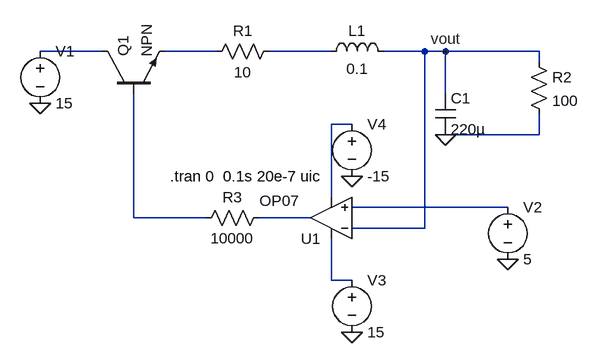
[diagram p0: schematic on_off_simple.asc]
on_off_simple.asc, the LTspice schematic file:
Version 4
SHEET 1 880 680
WIRE -256 32 -352 32
WIRE -80 32 -160 32
WIRE 96 32 0 32
WIRE 240 32 176 32
WIRE 272 32 240 32
WIRE 416 32 272 32
WIRE 416 48 416 32
WIRE 272 96 272 32
WIRE 128 144 96 144
WIRE 416 160 416 128
WIRE 416 160 272 160
WIRE 96 256 96 144
WIRE 368 272 128 272
WIRE -208 288 -208 96
WIRE -96 288 -208 288
WIRE 64 288 -16 288
WIRE 240 304 240 32
WIRE 240 304 128 304
WIRE 96 384 96 320
WIRE 128 384 96 384
FLAG 272 160 0
FLAG 272 32 vout
FLAG -352 112 0
FLAG 128 224 0
FLAG 128 464 0
FLAG 368 352 0
SYMBOL cap 256 96 R0
SYMATTR InstName C1
SYMATTR Value 220µ
SYMBOL res 16 16 R90
WINDOW 0 0 56 VBottom 2
WINDOW 3 32 56 VTop 2
SYMATTR InstName R1
SYMATTR Value 10
SYMBOL ind 80 48 R270
WINDOW 0 32 56 VTop 2
WINDOW 3 5 56 VBottom 2
SYMATTR InstName L1
SYMATTR Value 0.1
SYMBOL voltage -352 16 R0
WINDOW 123 0 0 Left 0
WINDOW 39 0 0 Left 0
SYMATTR InstName V1
SYMATTR Value 15
SYMBOL res 400 32 R0
SYMATTR InstName R2
SYMATTR Value 100
SYMBOL npn -256 96 R270
SYMATTR InstName Q1
SYMBOL res 0 272 R90
WINDOW 0 0 56 VBottom 2
WINDOW 3 32 56 VTop 2
SYMATTR InstName R3
SYMATTR Value 10000
SYMBOL OpAmps\\OP07 96 352 R180
WINDOW 3 49 90 Left 2
SYMATTR InstName U1
SYMBOL voltage 368 256 R0
WINDOW 123 0 0 Left 0
WINDOW 39 0 0 Left 0
SYMATTR InstName V2
SYMATTR Value 5
SYMBOL voltage 128 368 R0
WINDOW 123 0 0 Left 0
WINDOW 39 0 0 Left 0
SYMATTR InstName V3
SYMATTR Value 15
SYMBOL voltage 128 128 R0
WINDOW 123 0 0 Left 0
WINDOW 39 0 0 Left 0
SYMATTR InstName V4
SYMATTR Value -15
TEXT -152 224 Left 2 !.tran 0  0.1s 20e-7 uic

The netlist it stands for:
* on_off_simple.asc
C1 vout 0 220µ
R1 N003 N002 10
L1 N003 vout 0.1
V1 N001 0 15
R2 vout 0 100
Q1 N001 N006 N002 0 NPN
R3 N007 N006 10000
XU1 N005 vout N008 N004 N007 LT1001  ; OP07, pins In+ In- V+ V- OUT
V2 N005 0 5
V3 N008 0 15
V4 N004 0 -15
.model NPN NPN
.model PNP PNP
.lib standard.bjt
.tran 0  0.1s 20e-7 uic
.lib LTC.lib
.backanno
.end